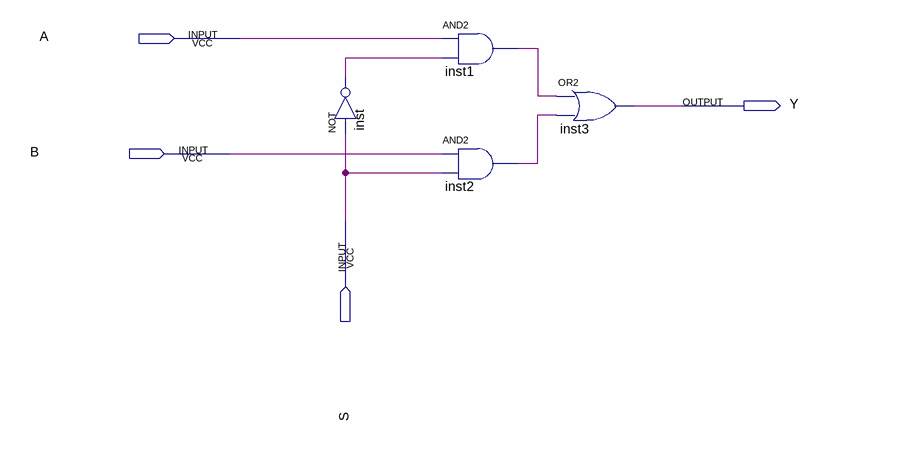
[diagram p0: schematic sheet]
// Quartus schematic MUX2.bdf as structural Verilog: 4 symbols, 4 pins
module MUX2 (
  input  A,
  input  B,
  input  S,
  output Y
);

  wire inst1_out, inst2_out, inst_out;

  not inst (inst_out, S);
  and inst1 (inst1_out, A, inst_out);
  and inst2 (inst2_out, B, S);
  or inst3 (Y, inst1_out, inst2_out);
endmodule
